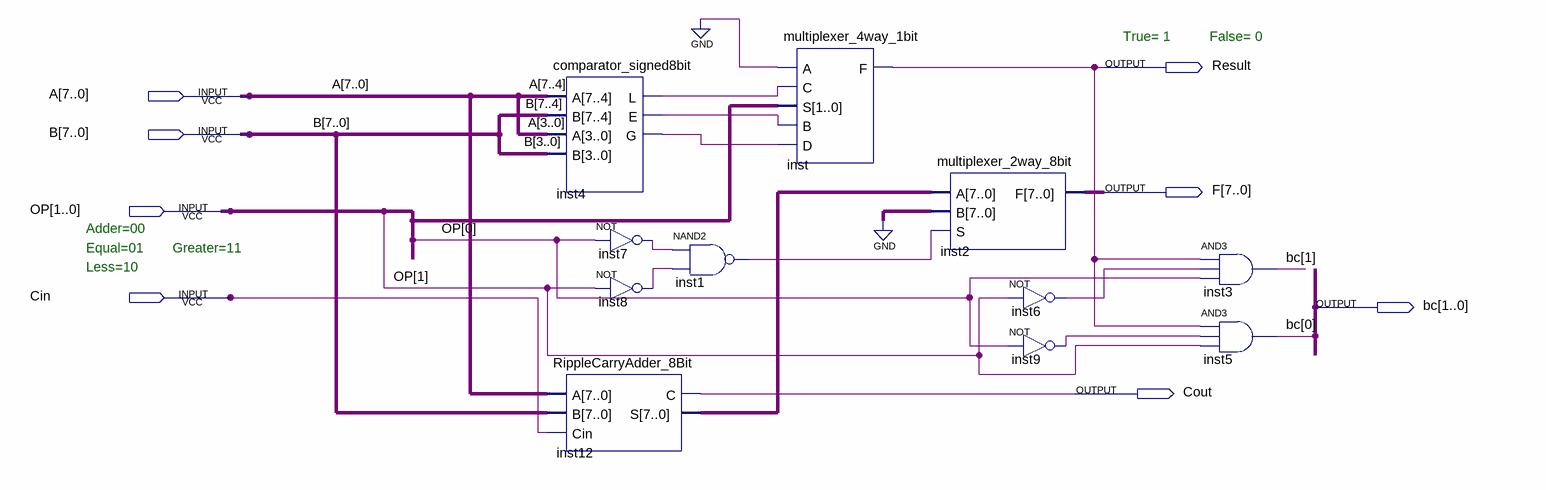
[diagram p0: schematic sheet]
// Quartus schematic ALU_8bit.bdf as structural Verilog: 11 symbols, 8 pins
module ALU_8bit (
  input  [7:0] A,
  input  [7:0] B,
  input  [1:0] OP,
  input  Cin,
  output Result,
  output [7:0] F,
  output [1:0] bc,
  output Cout
);

  wire inst1_out, inst4_e, inst4_g, inst4_l, inst6_out, inst7_out, inst8_out, inst9_out;
  wire [7:0] inst12_s;

  comparator_signed8bit inst4 (.A(A), .B(B), .L(inst4_l), .E(inst4_e), .G(inst4_g));
  RippleCarryAdder_8Bit inst12 (.A(A), .B(B), .Cin(Cin), .C(Cout), .S(inst12_s));
  not inst7 (inst7_out, OP[0]);
  not inst8 (inst8_out, OP[1]);
  nand inst1 (inst1_out, inst7_out, inst8_out);
  multiplexer_4way_1bit inst (.A(1'b0), .C(inst4_l), .S(OP), .B(inst4_e), .D(inst4_g), .F(Result));
  multiplexer_2way_8bit inst2 (.A(inst12_s), .B({8{1'b0}}), .S(inst1_out), .F(F));
  not inst6 (inst6_out, OP[1]);
  not inst9 (inst9_out, OP[0]);
  and inst3 (bc[1], Result, inst6_out, OP[0]);
  and inst5 (bc[0], Result, inst9_out, OP[1]);

  // Notes on the sheet:
  //   True= 1
  //   False= 0
  //   Adder=00
  //   Equal=01
  //   Greater=11
  //   Less=10
endmodule
